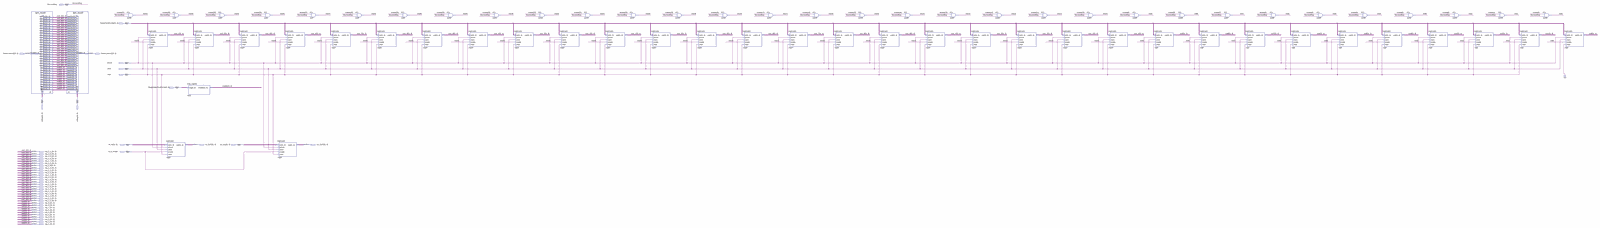
[diagram p0: schematic sheet, whole]
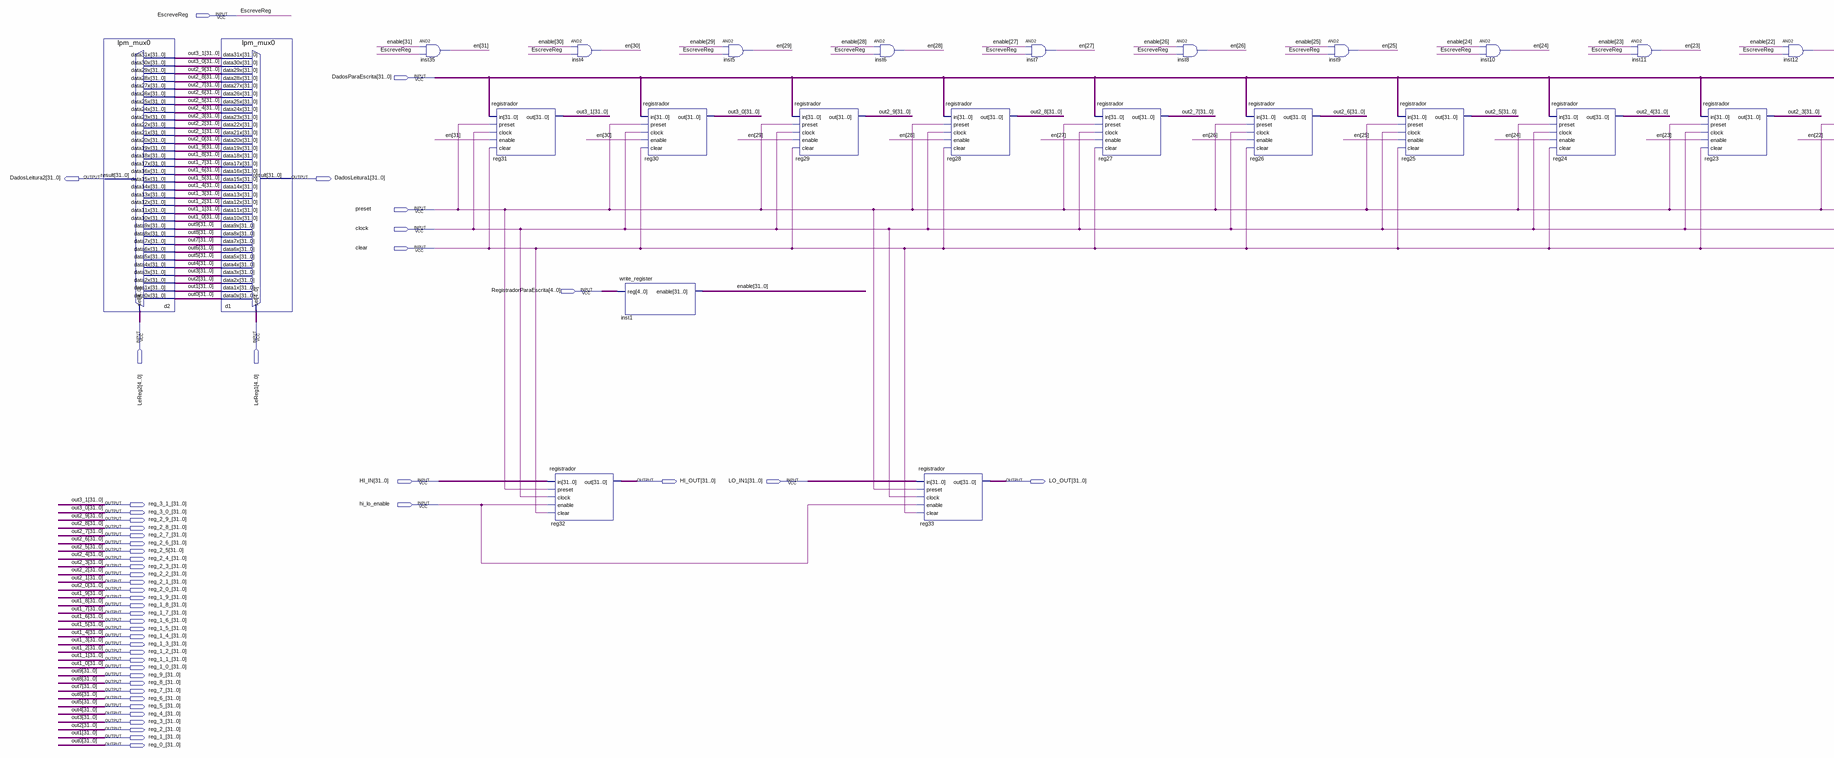
[diagram p1: schematic sheet, left part]
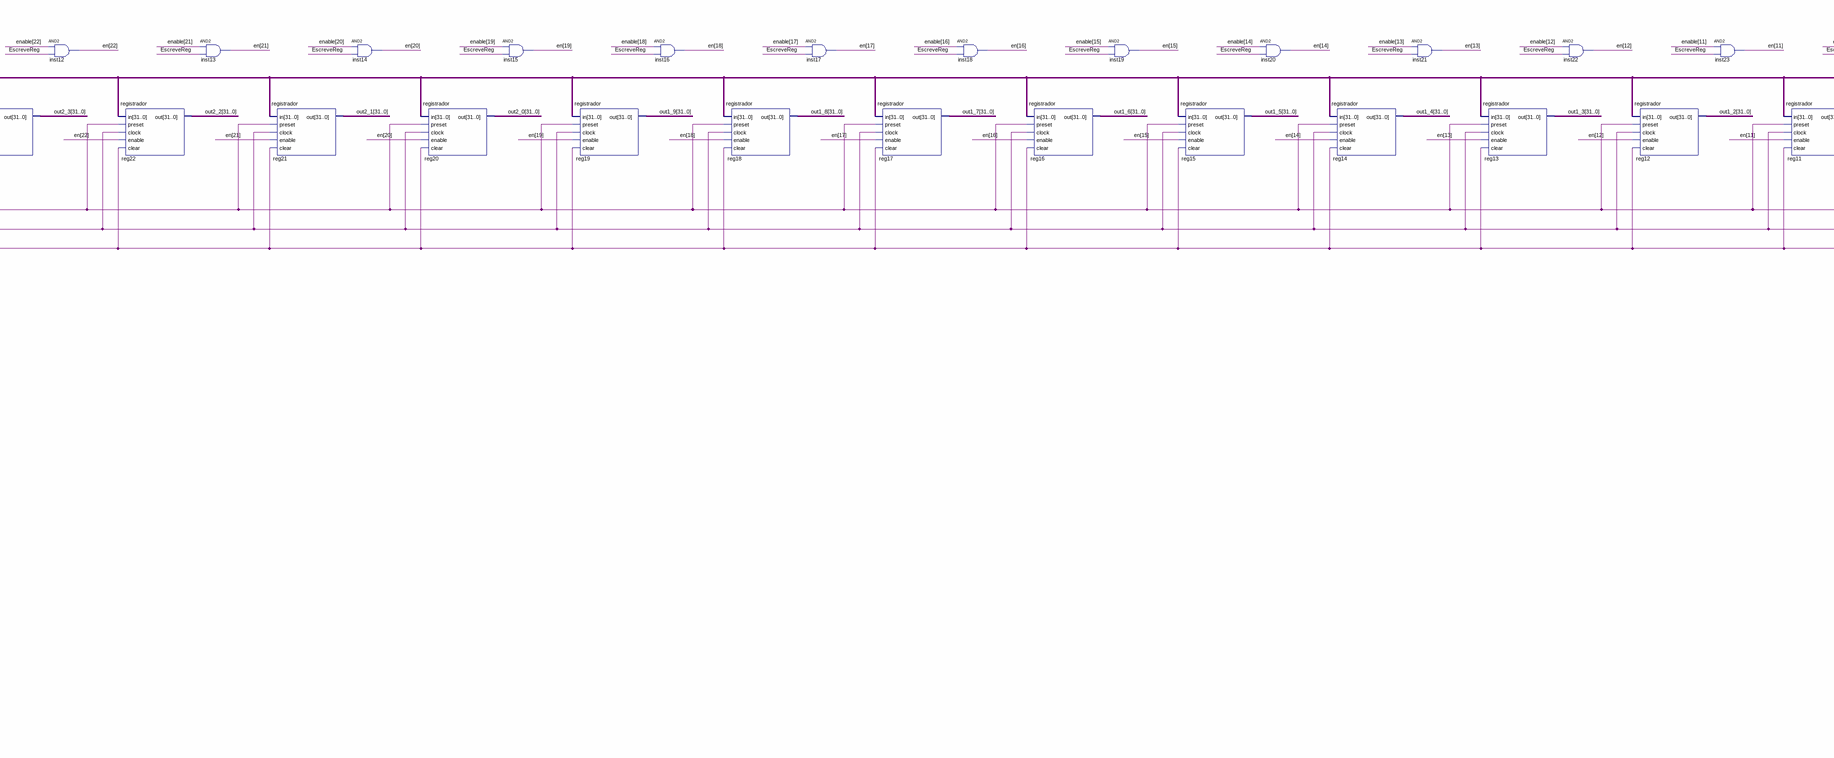
[diagram p2: schematic sheet, centre part]
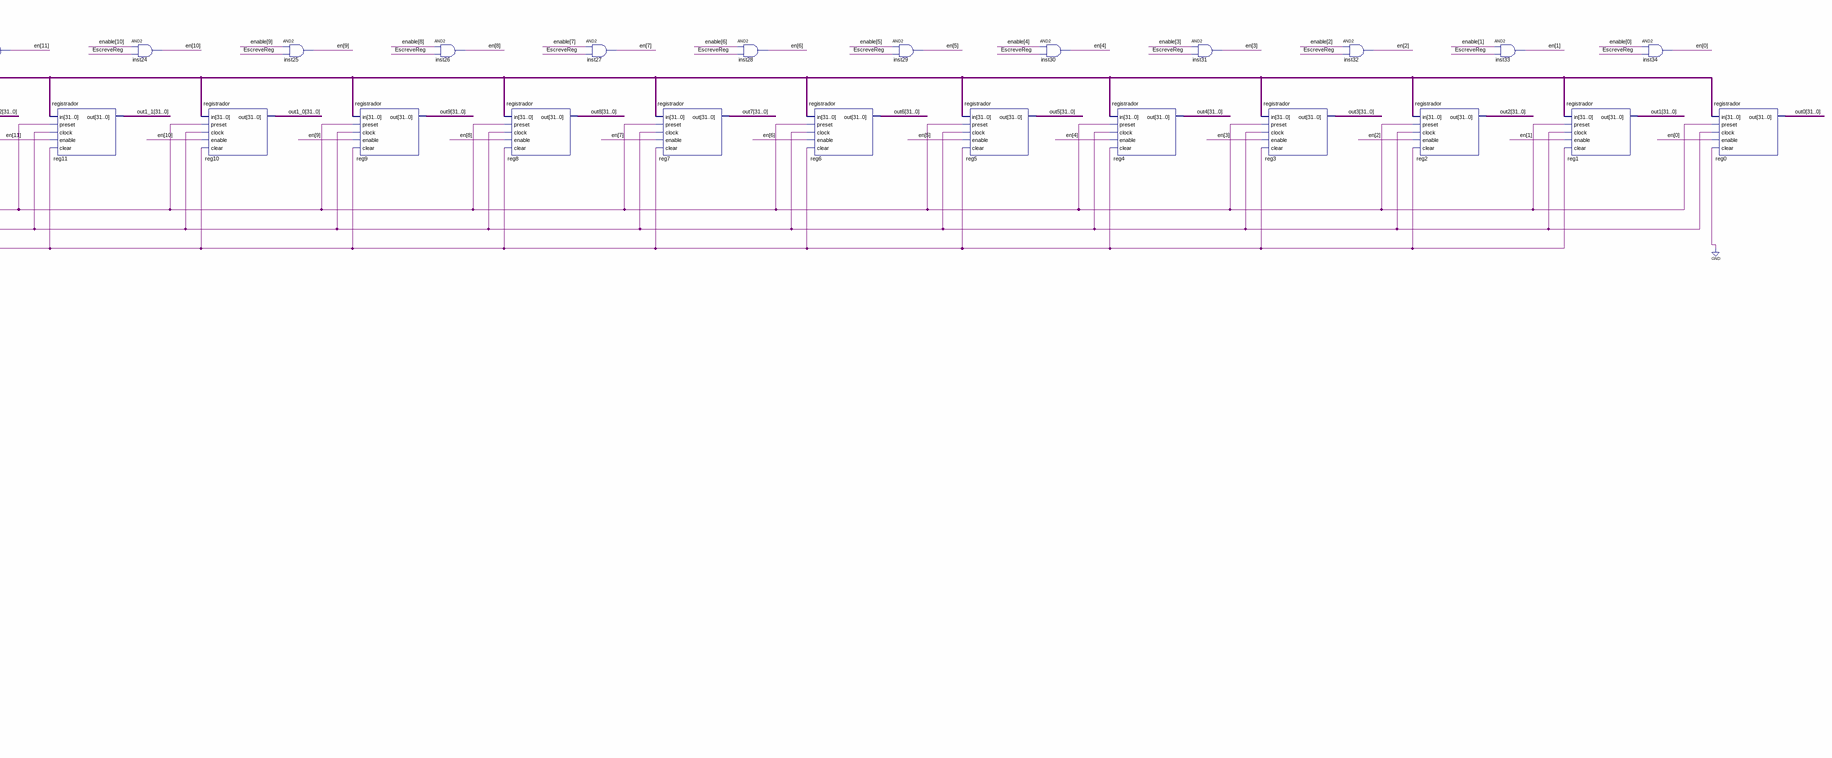
[diagram p3: schematic sheet, right part]
// Quartus schematic banco_reg.bdf as structural Verilog: 69 symbols, 47 pins
module banco_reg (
  input  EscreveReg,
  input  [31:0] DadosParaEscrita,
  input  preset,
  input  clock,
  input  clear,
  input  [4:0] RegistradorParaEscrita,
  input  [4:0] LeReg2,
  input  [4:0] LeReg1,
  input  [31:0] HI_IN,
  input  [31:0] LO_IN1,
  input  hi_lo_enable,
  output [31:0] DadosLeitura2,
  output [31:0] DadosLeitura1,
  output [31:0] HI_OUT,
  output [31:0] LO_OUT,
  output [31:0] reg_3_1_,
  output [31:0] reg_3_0_,
  output [31:0] reg_2_9_,
  output [31:0] reg_2_8_,
  output [31:0] reg_2_7_,
  output [31:0] reg_2_6_,
  output [31:0] reg_2_5,
  output [31:0] reg_2_4_,
  output [31:0] reg_2_3_,
  output [31:0] reg_2_2_,
  output [31:0] reg_2_1_,
  output [31:0] reg_2_0_,
  output [31:0] reg_1_9_,
  output [31:0] reg_1_8_,
  output [31:0] reg_1_7_,
  output [31:0] reg_1_6_,
  output [31:0] reg_1_5_,
  output [31:0] reg_1_4_,
  output [31:0] reg_1_3_,
  output [31:0] reg_1_2_,
  output [31:0] reg_1_1_,
  output [31:0] reg_1_0_,
  output [31:0] reg_9_,
  output [31:0] reg_8_,
  output [31:0] reg_7_,
  output [31:0] reg_6_,
  output [31:0] reg_5_,
  output [31:0] reg_4_,
  output [31:0] reg_3_,
  output [31:0] reg_2_,
  output [31:0] reg_1_,
  output [31:0] reg_0_
);

  wire [31:0] en, enable;

  lpm_mux0 d2 (
    .data31x(reg_3_1_), .data30x(reg_3_0_), .data29x(reg_2_9_), .data28x(reg_2_8_), .data27x(reg_2_7_),
    .data26x(reg_2_6_), .data25x(reg_2_5), .data24x(reg_2_4_), .data23x(reg_2_3_), .data22x(reg_2_2_),
    .data21x(reg_2_1_), .data20x(reg_2_0_), .data19x(reg_1_9_), .data18x(reg_1_8_), .data17x(reg_1_7_),
    .data16x(reg_1_6_), .data15x(reg_1_5_), .data14x(reg_1_4_), .data13x(reg_1_3_), .data12x(reg_1_2_),
    .data11x(reg_1_1_), .data10x(reg_1_0_), .data9x(reg_9_), .data8x(reg_8_), .data7x(reg_7_),
    .data6x(reg_6_), .data5x(reg_5_), .data4x(reg_4_), .data3x(reg_3_), .data2x(reg_2_), .data1x(reg_1_),
    .data0x(reg_0_), .sel(LeReg2), .result(DadosLeitura2));
  lpm_mux0 d1 (
    .data31x(reg_3_1_), .data30x(reg_3_0_), .data29x(reg_2_9_), .data28x(reg_2_8_), .data27x(reg_2_7_),
    .data26x(reg_2_6_), .data25x(reg_2_5), .data24x(reg_2_4_), .data23x(reg_2_3_), .data22x(reg_2_2_),
    .data21x(reg_2_1_), .data20x(reg_2_0_), .data19x(reg_1_9_), .data18x(reg_1_8_), .data17x(reg_1_7_),
    .data16x(reg_1_6_), .data15x(reg_1_5_), .data14x(reg_1_4_), .data13x(reg_1_3_), .data12x(reg_1_2_),
    .data11x(reg_1_1_), .data10x(reg_1_0_), .data9x(reg_9_), .data8x(reg_8_), .data7x(reg_7_),
    .data6x(reg_6_), .data5x(reg_5_), .data4x(reg_4_), .data3x(reg_3_), .data2x(reg_2_), .data1x(reg_1_),
    .data0x(reg_0_), .sel(LeReg1), .result(DadosLeitura1));
  and inst35 (en[31], enable[31], EscreveReg);
  registrador reg31 (
    .in(DadosParaEscrita), .preset(preset), .clock(clock), .enable(en[31]), .clear(clear), .out(reg_3_1_));
  registrador reg32 (.in(HI_IN), .preset(preset), .clock(clock), .enable(hi_lo_enable), .clear(clear), .out(HI_OUT));
  and inst4 (en[30], enable[30], EscreveReg);
  write_register inst1 (.\reg (RegistradorParaEscrita), .enable(enable));
  registrador reg30 (
    .in(DadosParaEscrita), .preset(preset), .clock(clock), .enable(en[30]), .clear(clear), .out(reg_3_0_));
  and inst5 (en[29], enable[29], EscreveReg);
  registrador reg29 (
    .in(DadosParaEscrita), .preset(preset), .clock(clock), .enable(en[29]), .clear(clear), .out(reg_2_9_));
  and inst6 (en[28], enable[28], EscreveReg);
  registrador reg33 (.in(LO_IN1), .preset(preset), .clock(clock), .enable(hi_lo_enable), .clear(clear), .out(LO_OUT));
  registrador reg28 (
    .in(DadosParaEscrita), .preset(preset), .clock(clock), .enable(en[28]), .clear(clear), .out(reg_2_8_));
  and inst7 (en[27], enable[27], EscreveReg);
  registrador reg27 (
    .in(DadosParaEscrita), .preset(preset), .clock(clock), .enable(en[27]), .clear(clear), .out(reg_2_7_));
  and inst8 (en[26], enable[26], EscreveReg);
  registrador reg26 (
    .in(DadosParaEscrita), .preset(preset), .clock(clock), .enable(en[26]), .clear(clear), .out(reg_2_6_));
  and inst9 (en[25], enable[25], EscreveReg);
  registrador reg25 (
    .in(DadosParaEscrita), .preset(preset), .clock(clock), .enable(en[25]), .clear(clear), .out(reg_2_5));
  and inst10 (en[24], enable[24], EscreveReg);
  registrador reg24 (
    .in(DadosParaEscrita), .preset(preset), .clock(clock), .enable(en[24]), .clear(clear), .out(reg_2_4_));
  and inst11 (en[23], enable[23], EscreveReg);
  registrador reg23 (
    .in(DadosParaEscrita), .preset(preset), .clock(clock), .enable(en[23]), .clear(clear), .out(reg_2_3_));
  and inst12 (en[22], enable[22], EscreveReg);
  registrador reg22 (
    .in(DadosParaEscrita), .preset(preset), .clock(clock), .enable(en[22]), .clear(clear), .out(reg_2_2_));
  and inst13 (en[21], enable[21], EscreveReg);
  registrador reg21 (
    .in(DadosParaEscrita), .preset(preset), .clock(clock), .enable(en[21]), .clear(clear), .out(reg_2_1_));
  and inst14 (en[20], enable[20], EscreveReg);
  registrador reg20 (
    .in(DadosParaEscrita), .preset(preset), .clock(clock), .enable(en[20]), .clear(clear), .out(reg_2_0_));
  and inst15 (en[19], enable[19], EscreveReg);
  registrador reg19 (
    .in(DadosParaEscrita), .preset(preset), .clock(clock), .enable(en[19]), .clear(clear), .out(reg_1_9_));
  and inst16 (en[18], enable[18], EscreveReg);
  registrador reg18 (
    .in(DadosParaEscrita), .preset(preset), .clock(clock), .enable(en[18]), .clear(clear), .out(reg_1_8_));
  and inst17 (en[17], enable[17], EscreveReg);
  registrador reg17 (
    .in(DadosParaEscrita), .preset(preset), .clock(clock), .enable(en[17]), .clear(clear), .out(reg_1_7_));
  and inst18 (en[16], enable[16], EscreveReg);
  registrador reg16 (
    .in(DadosParaEscrita), .preset(preset), .clock(clock), .enable(en[16]), .clear(clear), .out(reg_1_6_));
  and inst19 (en[15], enable[15], EscreveReg);
  registrador reg15 (
    .in(DadosParaEscrita), .preset(preset), .clock(clock), .enable(en[15]), .clear(clear), .out(reg_1_5_));
  and inst20 (en[14], enable[14], EscreveReg);
  registrador reg14 (
    .in(DadosParaEscrita), .preset(preset), .clock(clock), .enable(en[14]), .clear(clear), .out(reg_1_4_));
  and inst21 (en[13], enable[13], EscreveReg);
  registrador reg13 (
    .in(DadosParaEscrita), .preset(preset), .clock(clock), .enable(en[13]), .clear(clear), .out(reg_1_3_));
  and inst22 (en[12], enable[12], EscreveReg);
  registrador reg12 (
    .in(DadosParaEscrita), .preset(preset), .clock(clock), .enable(en[12]), .clear(clear), .out(reg_1_2_));
  and inst23 (en[11], enable[11], EscreveReg);
  registrador reg11 (
    .in(DadosParaEscrita), .preset(preset), .clock(clock), .enable(en[11]), .clear(clear), .out(reg_1_1_));
  and inst24 (en[10], enable[10], EscreveReg);
  registrador reg10 (
    .in(DadosParaEscrita), .preset(preset), .clock(clock), .enable(en[10]), .clear(clear), .out(reg_1_0_));
  and inst25 (en[9], enable[9], EscreveReg);
  registrador reg9 (.in(DadosParaEscrita), .preset(preset), .clock(clock), .enable(en[9]), .clear(clear), .out(reg_9_));
  and inst26 (en[8], enable[8], EscreveReg);
  registrador reg8 (.in(DadosParaEscrita), .preset(preset), .clock(clock), .enable(en[8]), .clear(clear), .out(reg_8_));
  and inst27 (en[7], enable[7], EscreveReg);
  registrador reg7 (.in(DadosParaEscrita), .preset(preset), .clock(clock), .enable(en[7]), .clear(clear), .out(reg_7_));
  and inst28 (en[6], enable[6], EscreveReg);
  registrador reg6 (.in(DadosParaEscrita), .preset(preset), .clock(clock), .enable(en[6]), .clear(clear), .out(reg_6_));
  and inst29 (en[5], enable[5], EscreveReg);
  registrador reg5 (.in(DadosParaEscrita), .preset(preset), .clock(clock), .enable(en[5]), .clear(clear), .out(reg_5_));
  and inst30 (en[4], enable[4], EscreveReg);
  registrador reg4 (.in(DadosParaEscrita), .preset(preset), .clock(clock), .enable(en[4]), .clear(clear), .out(reg_4_));
  and inst31 (en[3], enable[3], EscreveReg);
  registrador reg3 (.in(DadosParaEscrita), .preset(preset), .clock(clock), .enable(en[3]), .clear(clear), .out(reg_3_));
  and inst32 (en[2], enable[2], EscreveReg);
  registrador reg2 (.in(DadosParaEscrita), .preset(preset), .clock(clock), .enable(en[2]), .clear(clear), .out(reg_2_));
  and inst33 (en[1], enable[1], EscreveReg);
  registrador reg1 (.in(DadosParaEscrita), .preset(preset), .clock(clock), .enable(en[1]), .clear(clear), .out(reg_1_));
  and inst34 (en[0], enable[0], EscreveReg);
  registrador reg0 (.in(DadosParaEscrita), .preset(preset), .clock(clock), .enable(en[0]), .clear(1'b0), .out(reg_0_));

  // Other names for the same wires on the sheet: out0[31:0] = reg_0_; out1[31:0] = reg_1_; out1_0[31:0] = reg_1_0_;
  //   out1_1[31:0] = reg_1_1_; out1_2[31:0] = reg_1_2_; out1_3[31:0] = reg_1_3_; out1_4[31:0] = reg_1_4_;
  //   out1_5[31:0] = reg_1_5_; out1_6[31:0] = reg_1_6_; out1_7[31:0] = reg_1_7_; out1_8[31:0] = reg_1_8_;
  //   out1_9[31:0] = reg_1_9_; out2[31:0] = reg_2_; out2_0[31:0] = reg_2_0_; out2_1[31:0] = reg_2_1_;
  //   out2_2[31:0] = reg_2_2_; out2_3[31:0] = reg_2_3_; out2_4[31:0] = reg_2_4_; out2_5[31:0] = reg_2_5;
  //   out2_6[31:0] = reg_2_6_; out2_7[31:0] = reg_2_7_; out2_8[31:0] = reg_2_8_; out2_9[31:0] = reg_2_9_;
  //   out3[31:0] = reg_3_; out3_0[31:0] = reg_3_0_; out3_1[31:0] = reg_3_1_; out4[31:0] = reg_4_; out5[31:0] = reg_5_;
  //   out6[31:0] = reg_6_; out7[31:0] = reg_7_; out8[31:0] = reg_8_; out9[31:0] = reg_9_
endmodule
